# EAGLE schematic test_ckt (EAGLE 7.2.0)
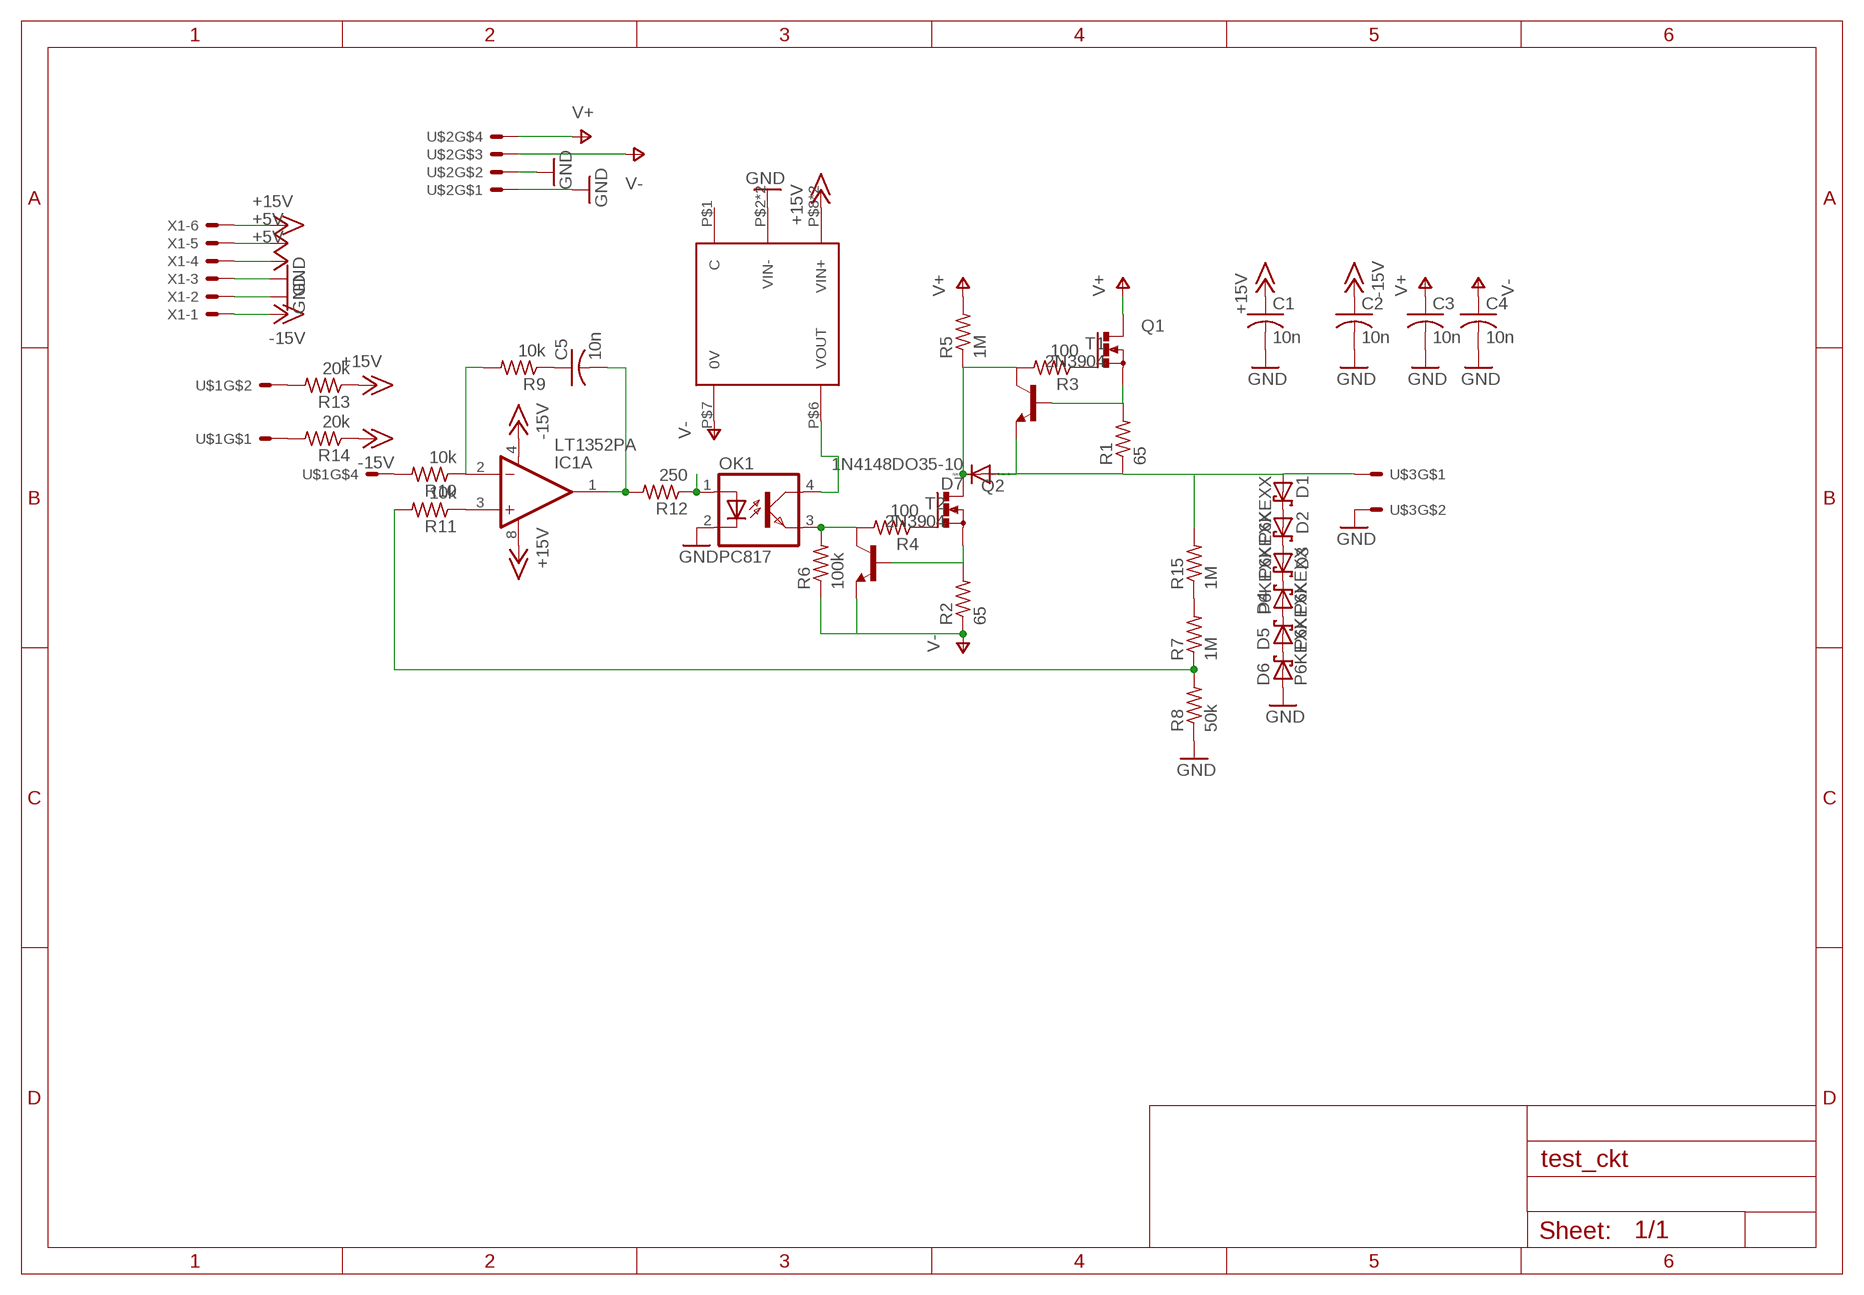
[diagram p0: schematic, sheet 1]

## Parts
C1  10n  C-US075-032X103  [C075-032X103]
C2  10n  C-US075-032X103  [C075-032X103]
C3  10n  C-US075-032X103  [C075-032X103]
C4  10n  C-US075-032X103  [C075-032X103]
C5  10n  C-US075-032X103  [C075-032X103]
D1  P6KEXX  [CB417-15]
D2  P6KEXX  [CB417-15]
D3  P6KEXX  [CB417-15]
D4  P6KEXX  [CB417-15]
D5  P6KEXX  [CB417-15]
D6  P6KEXX  [CB417-15]
D7  1N4148DO35-10  [DO35-10]
DC1  NCS  [NCS]
IC1  LT1352PA  [DIL08]
OK1  PC817  [DIL04]
Q1  PMOSFET_NTO220BV  [TO220BV]
Q2  PMOSFET_NTO220BV  [TO220BV]
R1  65  R-US_0207/10  [0207/10]
R2  65  R-US_0207/10  [0207/10]
R3  100  R-US_0207/10  [0207/10]
R4  100  R-US_0207/10  [0207/10]
R5  1M  R-US_0414/15  [0414/15]
R6  100k  R-US_0207/10  [0207/10]
R7  1M  R-US_0414/15  [0414/15]
R8  50k  R-US_0207/10  [0207/10]
R9  10k  R-US_0207/10  [0207/10]
R10  10k  R-US_0207/10  [0207/10]
R11  10k  R-US_0207/10  [0207/10]
R12  250  R-US_0207/15  [0207/15]
R13  20k  R-US_0207/10  [0207/10]
R14  20k  R-US_0207/10  [0207/10]
R15  1M  R-US_0414/15  [0414/15]
T1  2N3904  [TO92]
T2  2N3904  [TO92]
U$1  5569-4  [5669-4]
U$2  5569-4  [5669-4]
U$3  5569-2  [5569-2]
X1  KK-156-6  [KK-156-6]

## Nets
+5V: X1.4 X1.5
+15V: C1.1 DC1.P$8(VIN+) DC1.P$9(VIN+) IC1.8(A:V+) R13.1 X1.6
-15V: C2.1 IC1.4(A:V-) R14.1 X1.1
GND: C1.2 C2.2 C3.2 C4.2 D6.A DC1.P$2(VIN-) DC1.P$3(VIN-) OK1.2(C) R8.1 U$2.P$1 U$2.P$2 U$3.P$2 X1.2 X1.3
N$1: D1.C D2.A
N$2: D2.C D3.A
N$3: D3.C D4.C
N$4: D4.A D5.C
N$5: D5.A D6.C
N$6: Q1.G R3.1
N$7: D7.C Q2.D R3.2 R5.1 T1.1(C)
N$8: Q1.S R1.2 T1.2(B)
N$9: R13.2 U$1.P$2
N$10: D1.A D7.A R1.1 R15.2 T1.3(E) U$3.P$1
N$11: Q2.G R4.1
N$12: OK1.3(EMIT) R4.2 R6.2 T2.1(C)
N$13: R10.2 U$1.P$4
N$14: Q2.S R2.2 T2.2(B)
N$16: DC1.P$6(VOUT) OK1.4(COL)
N$17: C5.1 R9.1
N$18: IC1.2(A:-IN) R9.2 R10.1
N$19: C5.2 IC1.1(A:OUT) R12.2
N$20: IC1.3(A:+IN) R11.1
N$21: R7.1 R8.2 R11.2
N$23: R7.2 R15.1
N$24: R14.2 U$1.P$1
N$25: OK1.1(A) R12.1
V+: C3.1 Q1.D R5.2 U$2.P$4
V-: C4.1 DC1.P$7(0V) R2.1 R6.1 T2.3(E) U$2.P$3
Unconnected: DC1.P$1(C) IC1.5(B:+IN) IC1.6(B:-IN) IC1.7(B:OUT) U$1.P$3

## Library data of the parts
C1-C5 = rcl:C-US: CAPACITOR, American symbol
D1-D6 = diode:P6KEXX: DIODE transient-voltage suppressor
D7 = diode:1N4148: DIODE high speed (Philips)
DC1 = dc-dc-converter:NCS: DC-DC CONVERTER
IC1 = linear-technology:LT1352: Dual Operational Amplifiers Source: http://datasheets.maxim-ic.com/en/ds/ICL7612-ICL764X.pdf; OC_FARNELL: unknown; OC_NEWARK: unknown
OK1 = optocoupler:PC817: SHARP OPTO COUPLER; MPN: PC817X4J000F; OC_FARNELL: 9707727; OC_NEWARK: 97K7059
Q1 Q2 = transistor-power:PMOSFET_N: Power MOSFET N-Channel
R1-R4 R6 R8-R14 = rcl:R-US_: RESISTOR, American symbol
R5 R7 R15 = resistor:R-US_: RESISTOR, American symbol
T1 T2 = transistor:2N3904: NPN TRANSISTOR
U$1 U$2 = con-molex:5569-4
U$3 = con-molex:5569-2
X1 = con-molex:KK-156-6: KK 156 HEADER Source: http://www.molex.com/pdm_docs/sd/026604100_sd.pdf; OC_FARNELL: unknown; OC_NEWARK: unknown